# Altium schematic sheet Detection_Circuit_PCB_Sheet_02.SchDoc: Object Detection
size A; Date: 2018-MAR-26; Author: N. Schram; DrawnBy: N. Schram; Engineer: N. Schram; Revision: 0.2; SheetNumber: 3
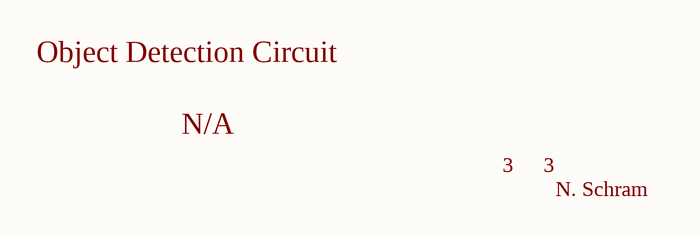
[diagram p0: Detection_Circuit_PCB_Sheet_02.SchDoc]

## Notes on the sheet
- Object Detection Circuit
- N/A
- 3
- N. Schram